# Altium project modulo_alimentador_prjpcb.PrjPcb
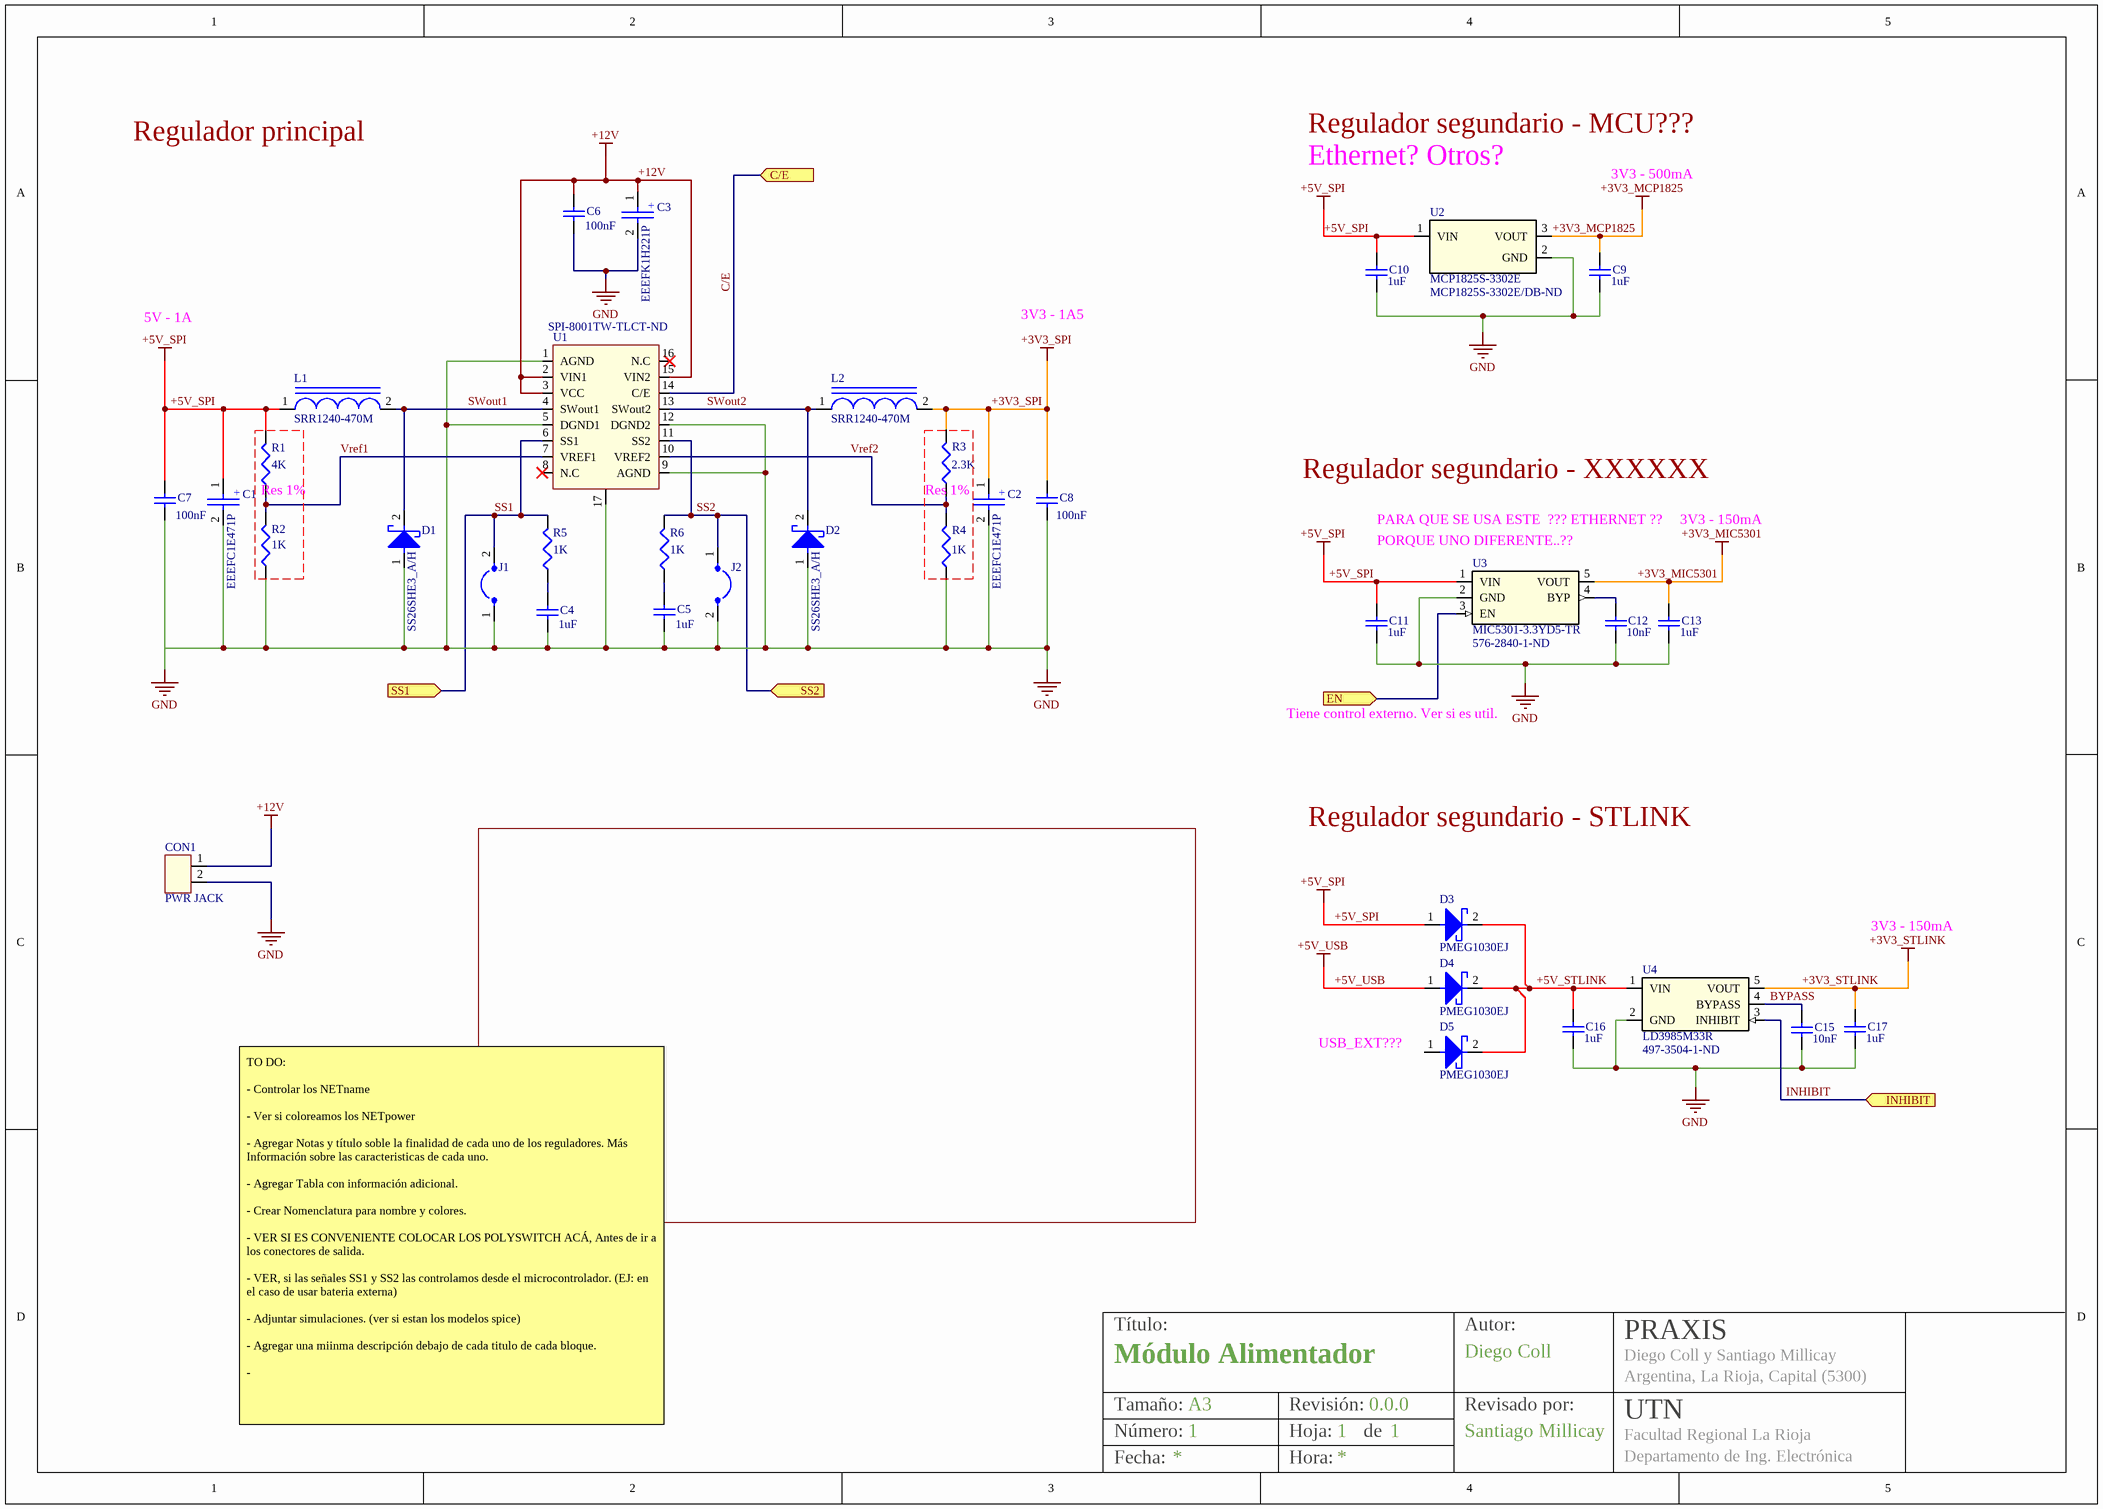
[diagram p0: modulo_alimentador_schdoc.SchDoc]
Institución: UTN; Institución_departamento: Departamento de Ing. Electrónica; Institución_localidad: Facultad Regional La Rioja; Proyecto: PRAXIS; Proyecto_integrantes: Diego Coll y Santiago Millicay; Proyecto_localidad: Argentina, La Rioja, Capital (5300)
1 sheet, 36 parts. Net scope: flat (ports and power ports of the same name join across sheets).
Board file: modulo_alimentador_pcbdoc.PcbDoc

## Sheet modulo_alimentador_schdoc.SchDoc: Módulo Alimentador
size 393 x 281 mm; CheckedBy: Santiago Millicay; Author: Diego Coll; DocumentNumber: 1; Revision: 0.0.0; SheetNumber: 1; SheetTotal: 1; CompanyName: Praxis; Organization: UTN; Address1: Argentina, La Rioja, Capital (5300); Address2: Frenchs Forest; Address3: NSW; Address4: Australia 2086; SheetFormat: A3

### Parts
C1  EEEFC1E471P  [PCE4009CT]
C2  EEEFC1E471P  [PCE4009CT]
C3  EEEFK1H221P  [PCE4009CT]
C4  value 1uF  [1608[0603]]  (hidden comment: Cap Semi)
C5  value 1uF  [1608[0603]]  (hidden comment: Cap Semi)
C6  value 100nF  [1608[0603]]  (hidden comment: Cap Semi)
C7  value 100nF  [1608[0603]]  (hidden comment: Cap Semi)
C8  value 100nF  [1608[0603]]  (hidden comment: Cap Semi)
C9  value 1uF  [1608[0603]]  (hidden comment: Cap Semi)
C10  value 1uF  [1608[0603]]  (hidden comment: Cap Semi)
C11  value 1uF  [1608[0603]]  (hidden comment: Cap Semi)
C12  value 10nF  [1608[0603]]  (hidden comment: Cap Semi)
C13  value 1uF  [1608[0603]]  (hidden comment: Cap Semi)
C15  value 10nF  [1608[0603]]  (hidden comment: Cap Semi)
C16  value 1uF  [1608[0603]]  (hidden comment: Cap Semi)
C17  value 1uF  [1608[0603]]  (hidden comment: Cap Semi)
CON1  PWR JACK  [694103107102]
D1  SS26SHE3_A/H  [SS26SHE3_A/H]
D2  SS26SHE3_A/H  [SS26SHE3_A/H]
D3  PMEG1030EJ  [PMEG1030EJ]
D4  PMEG1030EJ  [PMEG1030EJ]
D5  PMEG1030EJ  [PMEG1030EJ]
J1  JUMPER_SMD  [JUMPER_SMD]  (value not drawn)
J2  JUMPER_SMD  [JUMPER_SMD]  (value not drawn)
L1  SRR1240-470M  [SRR1240-470M]
L2  SRR1240-470M  [SRR1240-470M]
R1  value 4K  [J1-0603]  (hidden comment: Res3)
R2  value 1K  [J1-0603]  (hidden comment: Res3)
R3  value 2.3K  [J1-0603]  (hidden comment: Res3)
R4  value 1K  [J1-0603]  (hidden comment: Res3)
R5  value 1K  [J1-0603]  (hidden comment: Res3)
R6  value 1K  [J1-0603]  (hidden comment: Res3)
U1  Supplier Part Number 1: SPI-8001TW-TLCT-ND  [SOP127P1050X275_HS-17N]  (hidden comment: SPI-8001TW)
U2  MCP1825S-3302E  Supplier Part Number 1: MCP1825S-3302E/DB-ND  [MCP1825S-3302E]
U3  MIC5301-3.3YD5-TR  Supplier Part Number 1: 576-2840-1-ND  [MIC5301-3.3YD5-TR]
U4  LD3985M33R  Supplier Part Number 1: 497-3504-1-ND  [LD3985M33R]

### Ports
C/E (in), EN (in), INHIBIT (in), SS1 (in), SS2 (in)

### Nets
+3V3_MCP1825: C9.2 U2.3(VOUT)
+3V3_MIC5301: C13.1 U3.5(VOUT)
+3V3_SPI: C2.1 C8.1 L2.2 R3.2
+3V3_STLINK: C17.1 U4.5(VOUT)
+5V_SPI: C1.1 C7.1 C10.2 C11.1 D3.1(A) L1.1 R1.2 U2.1(VIN) U3.1(VIN)
+5V_USB: D4.1(A)
+12V: C3.1 C6.1 CON1.1 U1.2(VIN1) U1.3(VCC) U1.15(VIN2)
GND: C1.2 C2.2 C3.2 C4.1 C5.1 C6.2 C7.2 C8.2 C9.1 C10.1 C11.2 C12.2 C13.2 C15.2 C16.2 C17.2 CON1.2 D1.1(A) D2.1(A) J1.1 J2.2 R2.1 R4.1 U1.1(AGND) U1.5(DGND1) U1.9(AGND) U1.12(DGND2) U1.17(Thermal) U2.2(GND) U3.2(GND) U4.2(GND)
+5V_STLINK: C16.1 D3.2(K) D4.2(K) D5.2(K) U4.1(VIN)
BYPASS: C15.1 U4.4(BYPASS)
C/E: U1.14(C/E) ; port C/E
INHIBIT: U4.3(INHIBIT) ; port INHIBIT
SS1: J1.2 R5.2 U1.6(SS1) ; port SS1
SS2: J2.1 R6.2 U1.11(SS2) ; port SS2
SWout1: D1.2(K) L1.2 U1.4(SWout1)
SWout2: D2.2(K) L2.1 U1.13(SWout2)
Vref1: R1.1 R2.2 U1.7(VREF1)
Vref2: R3.1 R4.2 U1.10(VREF2)
NetC4_2: C4.2 R5.1
NetC5_2: C5.2 R6.1
NetC12_1: C12.1 U3.4(BYP)
NetU3_3: U3.3(EN) ; port EN

Not connected (* = marked no-connect by the designer): D5 1(A); U1 8(N.C)* 16(N.C)*

### Notes on the sheet
- Regulador principal
- Regulador segundario - MCU???
- Ethernet? Otros?
- 3V3 - 500mA
- 5V - 1A
- 3V3 - 1A5
- (near R1) Res 1%
- (near R3) Res 1%
- Regulador segundario - XXXXXX
- (near U3) PORQUE UNO DIFERENTE..??
- (near U3) PARA QUE SE USA ESTE  ??? ETHERNET ??
- 3V3 - 150mA
- Tiene control externo. Ver si es util.
- Regulador segundario - STLINK
- USB_EXT???
- TO DO:
  - Controlar los NETname
  - Ver si coloreamos los NETpower
  - Agregar Notas y título soble la finalidad de cada uno de los reguladores. Más Información sobre las caracteristicas de cada uno.
  - Agregar Tabla con información adicional.
  - Crear Nomenclatura para nombre y colores.
  - VER SI ES CONVENIENTE COLOCAR LOS POLYSWITCH ACÁ, Antes de ir a los conectores de salida.
  - VER, si las señales SS1 y SS2 las controlamos desde el microcontrolador. (EJ: en el caso de usar bateria externa)
  - Adjuntar simulaciones. (ver si estan los modelos spice)
  - Agregar una miinma descripción debajo de cada titulo de cada bloque.
  -
- Título:
- Autor:
- Tamaño:
- Número:
- Fecha:
- Revisión:
- Hoja:
- Hora:
- de
- Revisado por:
- (in symbol EEEFC1E471P) +
- (in symbol EEEFK1H221P) +

### Library data of the parts
C1 C2 = EEEFC1E471P: Capacitor 470uf electrolitico; Manufacturer: Panasonic; ESR (Equivalent Series Resistance): 150mR; Lead Diameter: 0.9mm; Leakage Current: 3uA; Life (Hours): 1000Hour; Material: Aluminium; Ripple Current: 670mA; Tolerance: 20%; Voltage: 25V; Capacitance: 470uF; Case/Package: Radial; Category: Aluminum Electrolytic Capacitors; Contact Plating: Tin; Diameter: 10mm; Height: 10.2mm; Height - Seated (Max): 0.402inch; Impedance: 150mR; Lead Free: Lead Free; Lead Pitch: 4.6mm; Length: 10.5mm; Manufacturer Part Number: EEEFC1E471P; Max Operating Temperature: 105°C; Min Operating Temperature: -40°C; Mount: Surface Mount,PCB; Package Quantity: 1; Packaging: Tape and Reel; Radiation Hardening: No; REACH SVHC: No SVHC; Ripple Current (AC): 670mA; Termination: SMD/SMT; Voltage Rating: 25V; Voltage Rating (DC): 25V; Width: 900um
C3 = EEEFK1H221P: Capacitor 220uf electrolitico; Manufacturer: Panasonic; Manufacturer Part Number: EEE-FK1H221P; Dielectric Material: Aluminium; ESR (Equivalent Series Resistance): 180mR; Leakage Current: 3uA; Life (Hours): 2000Hour; Polarity: Polar; Ripple Current: 670mA; Tolerance: 20%; Voltage: 50V; Width: 12mm; Capacitance: 220uF; Case/Package: Radial; Category: Aluminum Electrolytic Capacitors; Contact Plating: Tin; Diameter: 10mm; Height: 10.2mm; Height - Seated (Max): 0.413inch; Impedance: 180mR; Lead Free: Lead Free; Length: 10.2mm; Material: Aluminium; Max Operating Temperature: 105°C; Min Operating Temperature: -55°C; Mount: Surface Mount,PCB; Number of Pins: 2; Package Quantity: 500; Packaging: Tape and Reel; Radiation Hardening: No; REACH SVHC: No SVHC; Ripple Current (AC): 670mA; Termination: SMD/SMT; Voltage Rating: 50V; Voltage Rating (DC): 50V
C4-C13 C15-C17 = Cap Semi: Capacitor (Semiconductor SIM Model); Published: 8-Jun-2000; LatestRevisionDate: 29-May-2009; LatestRevisionNote: IPC-7351 Footprint Added.; PackageReference: C1206; Publisher: Altium Limited; PackageDescription: Chip Capacitor
CON1 = 694103107102: CONN PWR JACK DC RA SMD; Manufacturer: Wurth Electronics; Connector Type: Jack,Power; Insulation Resistance: 100MR; Voltage Rating (DC): 18V; Gender: Male; Shielding: Unshielded; Current Rating: 5A; Supplier 1: Digi-Key; Manufacturer Part Number: 694103107102; RoHS: Yes; Category: Connectors; Stock 1: 467; Pricing 1: 1=1,56000, 10=1,48500, 50=1,32600, 100=1,22000 (USD); Mount: Surface Mount; Color: Black; Contact Material: Copper Alloy; Contact Plating: Tin; Housing Material: Polyamide; Min Operating Temperature: -40°C; Max Operating Temperature: 85°C; Contact Gender: Female; Package Quantity: 500; Packaging: Tape and Reel; Termination: SMD/SMT; Voltage Rating: 18V; Flammability Rating: UL94 V-0; REACH SVHC: Unknown; ComponentLink1URL: http://www.mouser.com/ds/2/445/6941xx107102-469263.pdf?src-supplier=Mouser; ComponentLink1Description: http://www.mouser.com/ds/2/445/6941xx107102-469263.pdf?src-supplier=Mouser; ComponentLink2URL: http://www.farnell.com/cad/2130962.pdf?src-supplier=Element14; ComponentLink2Description: http://www.farnell.com/cad/2130962.pdf?src-supplier=Element14
D1 D2 = SS26SHE3_A/H: Diodo schottky 60V 2A; Manufacturer: Vishay; Manufacturer Part Number: SS26SHE3"A/H; Element Configuration: Single; Forward Voltage: 750mV; Max Forward Surge Current (Ifsm): 40A; Peak Reverse Current: 10mA; Average Rectified Current: 2A; Case/Package: SMA; Category: Rectifier Diodes; Forward Current: 2A; Height: 2.29mm; Lead Free: Lead Free; Length: 4.5mm; Max Operating Temperature: 150°C; Max Repetitive Reverse Voltage (Vrrm): 60V; Max Reverse Voltage (DC): 60V; Min Operating Temperature: -55°C; Mount: Surface Mount; Number of Pins: 2; Package Quantity: 1800; Packaging: Tape and Reel; Peak Non-Repetitive Surge Current: 40A; Radiation Hardening: No; Reverse Voltage (DC): 60V; Termination: SMD/SMT; Weight: 0.001199oz; Width: 2.79mm
D3-D5 = PMEG1030EJ: DIODO SCHOTTKY; Manufacturer: Nexperia; Manufacturer Part Number: PMEG1030EJ,115
J1 J2 = JUMPER_SMD: JUMPER SMD Pitch  2.54mm; Manufacturer: Samtec; Manufacturer Part Number: TSM-102-01-L-SV-TR; Connector Type: Male Pin; Gender: Male; Max Current Rating: 7A; Max Voltage Rating (AC): 475V; Number of Contacts: 2; Category: Headers and Wire Housings; Color: Black; Contact Material: Bronze; Contact Mating Length: 0.23inch; Contact Plating: Gold; Depth: 2.54mm; Housing Color: Black; Housing Material: Polymer; Lead Free: Lead Free; Length: 5.08mm; Max Operating Temperature: 125°C; Min Operating Temperature: -55°C; Mount: Surface Mount; Number of Positions: 2; Number of Rows: 1; Orientation: Straight; Packaging: Tape and Reel; Pitch: 2.54mm; Radiation Hardening: No; REACH SVHC: No SVHC; Termination: Solder
L1 L2 = SRR1240-470M: Inductor fijo con nucleo.; Manufacturer: Bourns; Core Material: Ferrite; Current Rating: 2A; DC Resistance (DCR): 135mR; Frequency: 13MHz; Inductance: 47uH; Inductance Tolerance: 20%; Material: Steel; Q Factor: 19; Saturation Current: 1.8A; Shielding: Shielded; Test Frequency: 100kHz; Width: 12.5mm; Case/Package: Nonstandard; Category: Fixed Inductors; Composition: Wirewound; DC Current: 2A; Depth: 12.8mm; Height: 4mm; Height - Seated (Max): 0.177inch; Length: 12.5mm; Manufacturer Part Number: SRR1240-470M; Max DC Current: 2A; Max Operating Temperature: 125°C; Military Standard: Not; Min Operating Temperature: -40°C; Mount: Surface Mount; Package Quantity: 800; Packaging: Cut Tape; Radiation Hardening: No; REACH SVHC: No SVHC; Resistance: 135MR; RMS Current (Irms): 2A; Self Resonant Frequency: 13MHz; Termination: SMD/SMT; Tolerance: 20%
R1-R6 = Res3: Resistor; Published: 8-Jun-2000; LatestRevisionDate: 29-May-2009; LatestRevisionNote: IPC-7351 Footprint Added.; PackageReference: J1-0603; Publisher: Altium Limited; PackageDescription: Chip Resistor
U1 = SPI-8001TW-TL: IC REG BUCK ADJ 1.5A DL 16-HSOP; Manufacturer: Allegro MicroSystems Sanken; Max Input Voltage: 20V; Max Output Voltage: 16V; Min Input Voltage: 4V; Min Output Voltage: 1V; Number of Outputs: 2; Output Configuration: Positive; Output Type: Adjustable; Switching Frequency: 250kHz; Synchronous Rectifier: No; Case/Package: SOIC; Category: Voltage Regulators - Switching; Manufacturer Part Number: SPI-8001TW-TL; Max Operating Temperature: 135°C; Min Operating Temperature: -30°C; Mount: Surface Mount; Number of Pins: 16; Output Current: 1.5A; Package Quantity: 1400; Packaging: Tape and Reel; Supplier 1: Digi-Key; RoHS: Yes; Stock 1: 1392; Pricing 1: 1=3,10000, 10=2,78500, 25=2,63240, 100=2,16450, 250=1,94220, 500=1,87200 (USD); ComponentLink1URL: https://datasheet.ciiva.com/29734/spi-8001tw-ds-en-29734001.pdf?src-supplier=Digi-Key; ComponentLink1Description: https://datasheet.ciiva.com/29734/spi-8001tw-ds-en-29734001.pdf?src-supplier=Digi-Key; ComponentLink2URL: https://datasheet.ciiva.com/29733/h1-o03eh0-29733998.pdf?src-supplier=Digi-Key; ComponentLink2Description: https://datasheet.ciiva.com/29733/h1-o03eh0-29733998.pdf?src-supplier=Digi-Key; ComponentLink3URL: https://datasheet.ciiva.com/29733/h1-o03eh0-29733994.pdf?src-supplier=Digi-Key; ComponentLink3Description: https://datasheet.ciiva.com/29733/h1-o03eh0-29733994.pdf?src-supplier=Digi-Key
U2 = MCP1825S-3302E: MCP1825 Series 500 mA Low Quiescent Current LDO Regulator - SOT-223-3; Manufacturer: Microchip; Manufacturer Part Number: MCP1825S-3302E/DB; Category: Voltage Regulators - Linear; Supplier 1: Digi-Key; RoHS: Yes; Stock 1: 2086; Pricing 1: 1=0,51000, 25=0,43000, 100=0,39000 (USD); ComponentLink1URL: https://datasheet.ciiva.com/2040/22056b-2040962.pdf?src-supplier=Digi-Key; ComponentLink1Description: https://datasheet.ciiva.com/2040/22056b-2040962.pdf?src-supplier=Digi-Key; ComponentLink2URL: https://datasheet.ciiva.com/16369/filehandler-aspxddocname-en531698-16369574.pdf?src-supplier=Future+Electronics; ComponentLink2Description: https://datasheet.ciiva.com/16369/filehandler-aspxddocname-en531698-16369574.pdf?src-supplier=Future+Electronics; ComponentLink3URL: https://datasheet.ciiva.com/3224/22056b-3224139.pdf?src-supplier=Avnet; ComponentLink3Description: https://datasheet.ciiva.com/3224/22056b-3224139.pdf?src-supplier=Avnet; ComponentLink4URL: https://datasheet.ciiva.com/8041/514217-8041499.pdf?src-supplier=Element14; ComponentLink4Description: https://datasheet.ciiva.com/8041/514217-8041499.pdf?src-supplier=Element14
U3 = MIC5301-3.3YD5-TR: LDO VOLT REG, 0.15A, 3.3V, TSOT-23-5; Input Voltage Min:2.3V; Input Voltage Max:5.5V; Output Voltage Nom.:3.3V; Output Current:150mA; Dropout Voltage Vdo:40mV; LDO Regulator Case Style:TSOT-23; No. of Pins:5; Operating Temperature Min:-40°C; Operating Temperature Max:125°C; Packaging:Cut Tape; MSL:MSL 1 - Unlimited; SVHC:No SVHC (15-Jun-2015); Manufacturer: Microchip; Category: Voltage Regulators - Linear; Manufacturer Part Number: MIC5301-3.3YD5-TR; Supplier 1: Digi-Key; RoHS: Yes; Stock 1: 2373; Pricing 1: 1=0,59000, 25=0,49000, 100=0,45000 (USD); ComponentLink1URL: https://datasheet.ciiva.com/2049/mic5301-2049830.pdf?src-supplier=Digi-Key; ComponentLink1Description: https://datasheet.ciiva.com/2049/mic5301-2049830.pdf?src-supplier=Digi-Key; ComponentLink2URL: https://datasheet.ciiva.com/46425/1670788-46425623.pdf?src-supplier=Element14; ComponentLink2Description: https://datasheet.ciiva.com/46425/1670788-46425623.pdf?src-supplier=Element14
U4 = LD3985M33R: LDO Regulator Pos 3.3V 0.55A 5-Pin SOT-23 T/R; Vendor: STMicroelectronics; Built_By: EMA_UL_Team; Accuracy: 2%; Dropout Voltage: 60mV; Input Bias Current: 85uA; Max Input Voltage: 6V; Max Output Current: 150mA; Min Current Limit: 300mA; Min Input Voltage: 2.5V; Number of Outputs: 1; Output Type: Fixed; Polarity: Positive; Quiescent Current: 150uA; Manufacturer_Part_Number: LD3985M33R; Copyright: Copyright (C) 2018 Accelerated Designs. All rights reserved; RefDes: RefDes; Type: DEV; Value: Value; Width: 1.75mm; Case/Package: SOT-23; Category: Voltage Regulators - Linear; Height: 1.3mm; Lead Free: Lead Free; Length: 3mm; Manufacturer: STMicroelectronics; Manufacturer Part Number: LD3985M33R; Max Operating Temperature: 125°C; Min Operating Temperature: -40°C; Min Output Voltage: 3.3V; Mount: Surface Mount; Number of Pins: 5; Number of Regulators: 1; Output Current: 150mA; Output Voltage: 3.3V; Output Voltage Accuracy: 2%; Package Quantity: 1; Packaging: Tape and Reel; Radiation Hardening: No; Supplier 1: Digi-Key; RoHS: Yes; Stock 1: 4469; Pricing 1: 1=0,60000, 10=0,52800, 25=0,49600, 100=0,37600, 250=0,32000, 500=0,30400, 1000=0,23200 (USD); ComponentLink1URL: https://datasheet.ciiva.com/41440/001185181-da-01-en-ic-reg-ldo-3-3v-ld3985m33r-sot-23-5-stm-41440289.pdf?src-supplier=Conrad; ComponentLink1Description: https://datasheet.ciiva.com/41440/001185181-da-01-en-ic-reg-ldo-3-3v-ld3985m33r-sot-23-5-stm-41440289.pdf?src-supplier=Conrad; ComponentLink2URL: https://datasheet.ciiva.com/26905/ld3985m33r-26905032.pdf?src-supplier=IIIC; ComponentLink2Description: https://datasheet.ciiva.com/26905/ld3985m33r-26905032.pdf?src-supplier=IIIC; ComponentLink3URL: https://datasheet.ciiva.com/2042/cd00003395-2042198.pdf?src-supplier=Digi-Key; ComponentLink3Description: https://datasheet.ciiva.com/2042/cd00003395-2042198.pdf?src-supplier=Digi-Key; ComponentLink4URL: https://datasheet.ciiva.com/2042/cd00003395-2042200.pdf?src-supplier=Digi-Key; ComponentLink4Description: https://datasheet.ciiva.com/2042/cd00003395-2042200.pdf?src-supplier=Digi-Key; ComponentLink5URL: https://datasheet.ciiva.com/2042/cd00003395-2042199.pdf?src-supplier=Digi-Key; ComponentLink5Description: https://datasheet.ciiva.com/2042/cd00003395-2042199.pdf?src-supplier=Digi-Key; ComponentLink6URL: https://datasheet.ciiva.com/16591/cd00003395-16591967.pdf?src-supplier=Avnet+Europe; ComponentLink6Description: https://datasheet.ciiva.com/16591/cd00003395-16591967.pdf?src-supplier=Avnet+Europe